# Altium schematic sheet PAGE1 - CONTENTS.SchDoc
size A3; DocumentNumber: 1; SheetNumber: 1; SheetTotal: 1
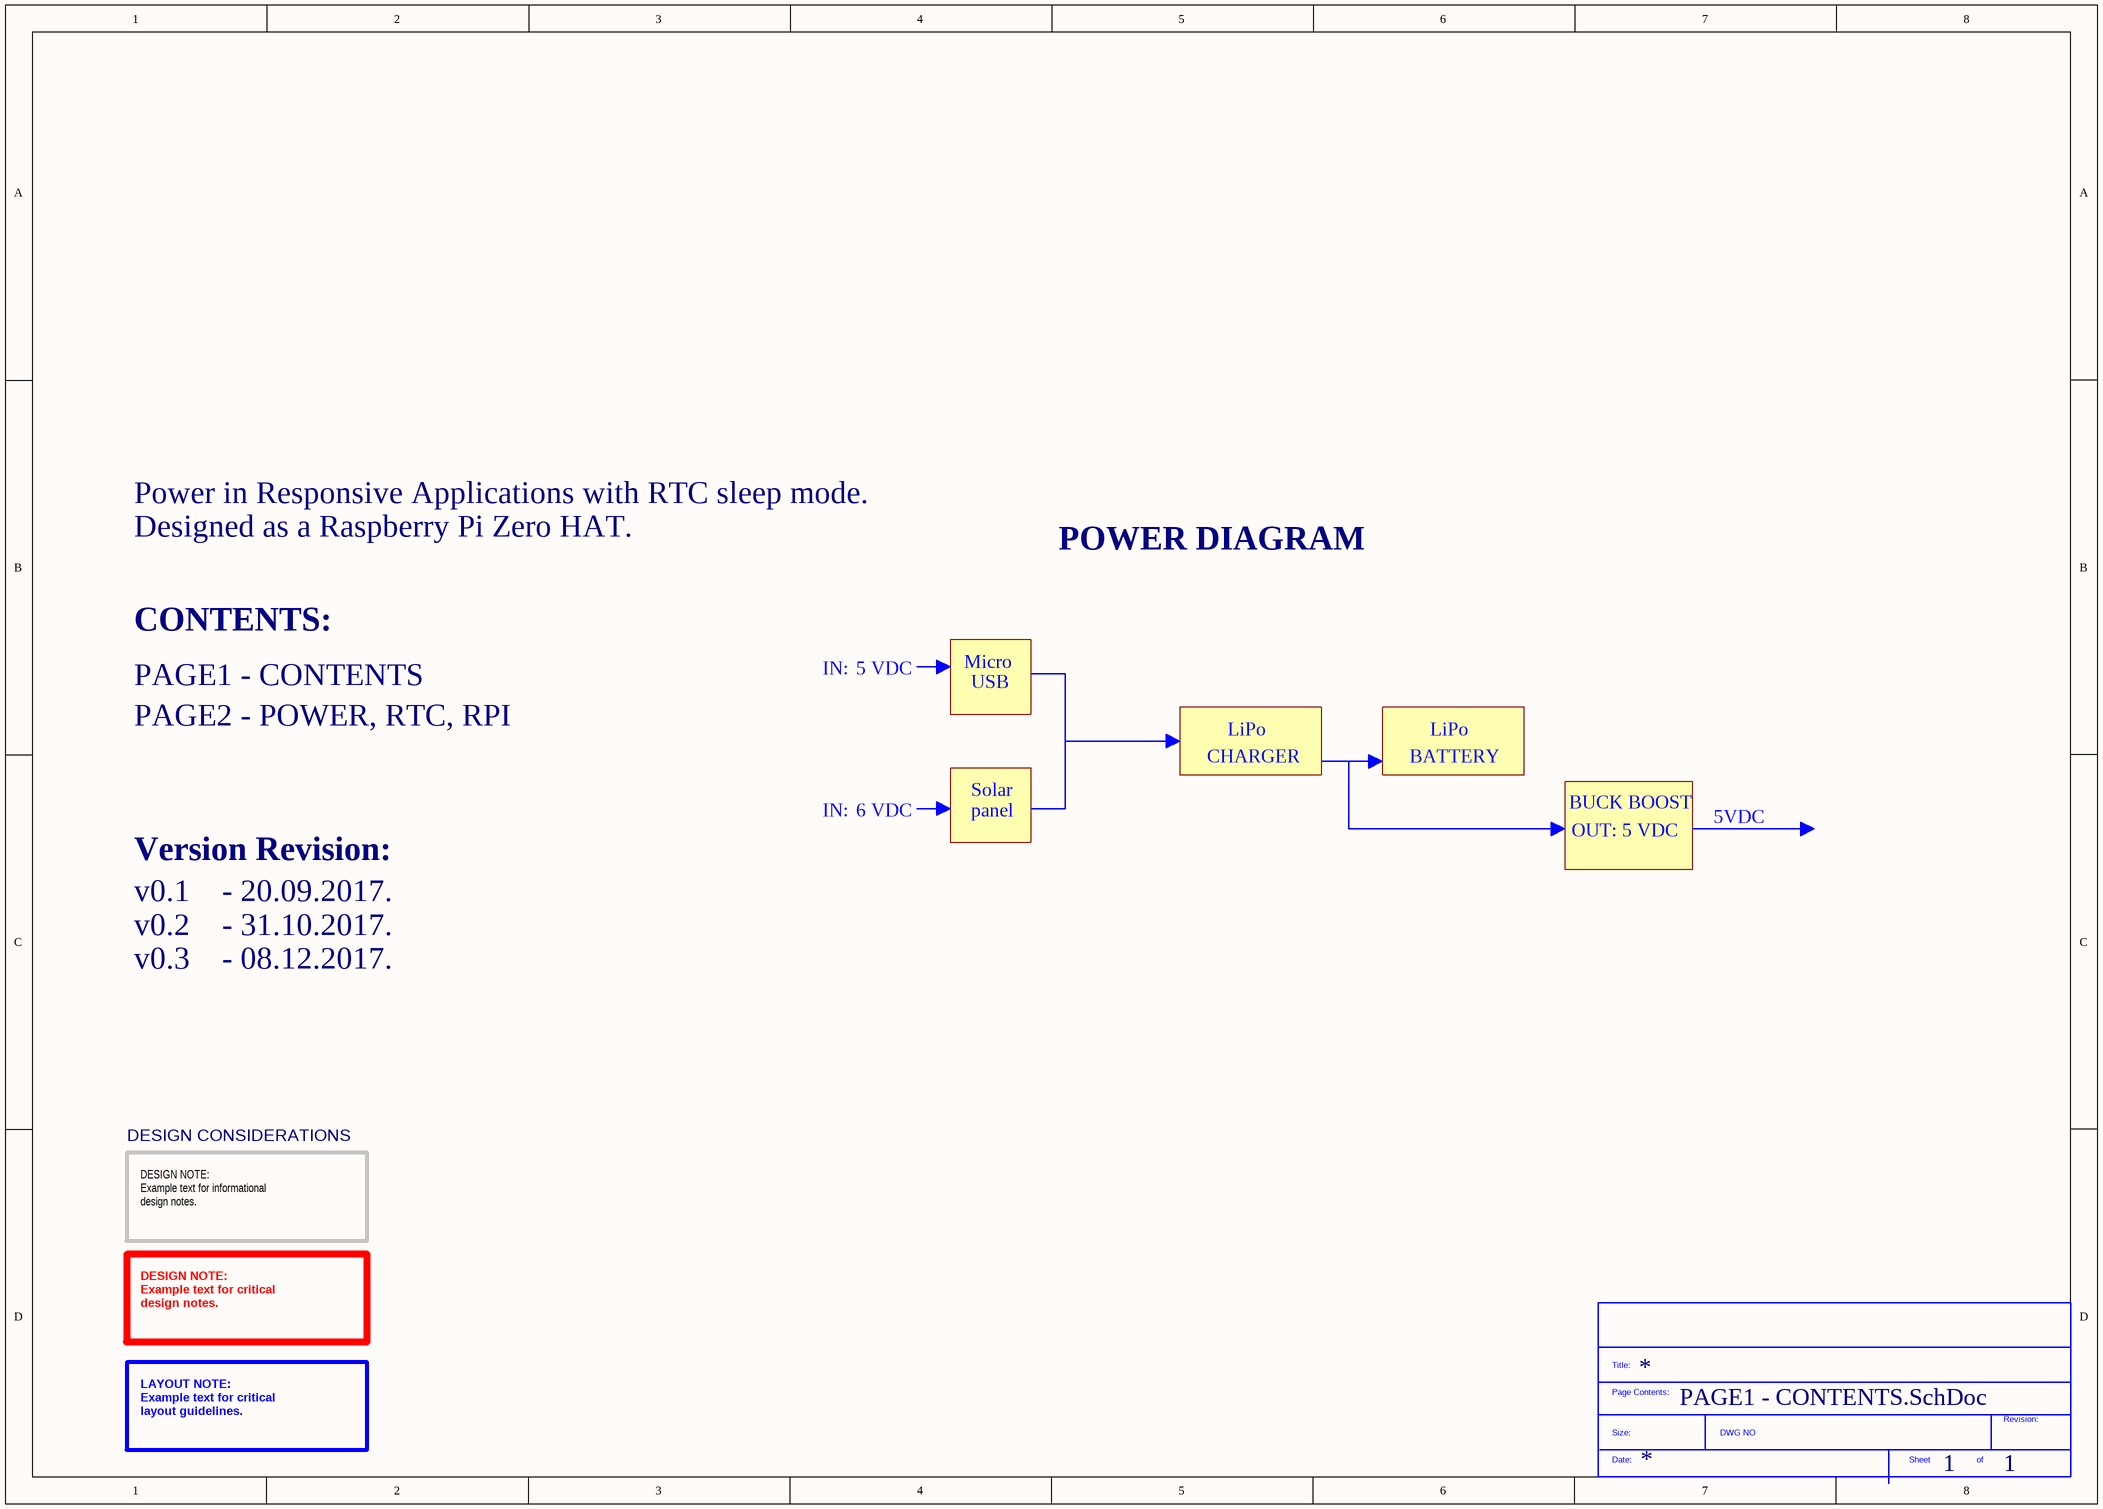
[diagram p0: PAGE1 - CONTENTS.SchDoc]

## Parts
*?  SDTitleBlock  (value not drawn)  (graphical)

## Notes on the sheet
- Power in Responsive Applications with RTC sleep mode.
- Designed as a Raspberry Pi Zero HAT.
- POWER DIAGRAM
- CONTENTS:
- PAGE1 - CONTENTS
- IN:
- 5 VDC
- Micro
- USB
- PAGE2 - POWER, RTC, RPI
- CHARGER
- LiPo
- BATTERY
- 6 VDC
- Solar
- panel
- BUCK BOOST
- OUT: 5 VDC
- 5VDC
- Version Revision:
- v0.1    - 20.09.2017.
- v0.2    - 31.10.2017.
- v0.3    - 08.12.2017.
- DESIGN CONSIDERATIONS
- DESIGN NOTE:
  Example text for informational
  design notes.
- DESIGN NOTE:
  Example text for critical
  design notes.
- LAYOUT NOTE:
  Example text for critical
  layout guidelines.
- (in symbol SDTitleBlock) Title:; Page Contents:; Revision:; Size:; DWG NO; Date:; Sheet; of